# EAGLE design Brain (EAGLE 9.3.1)
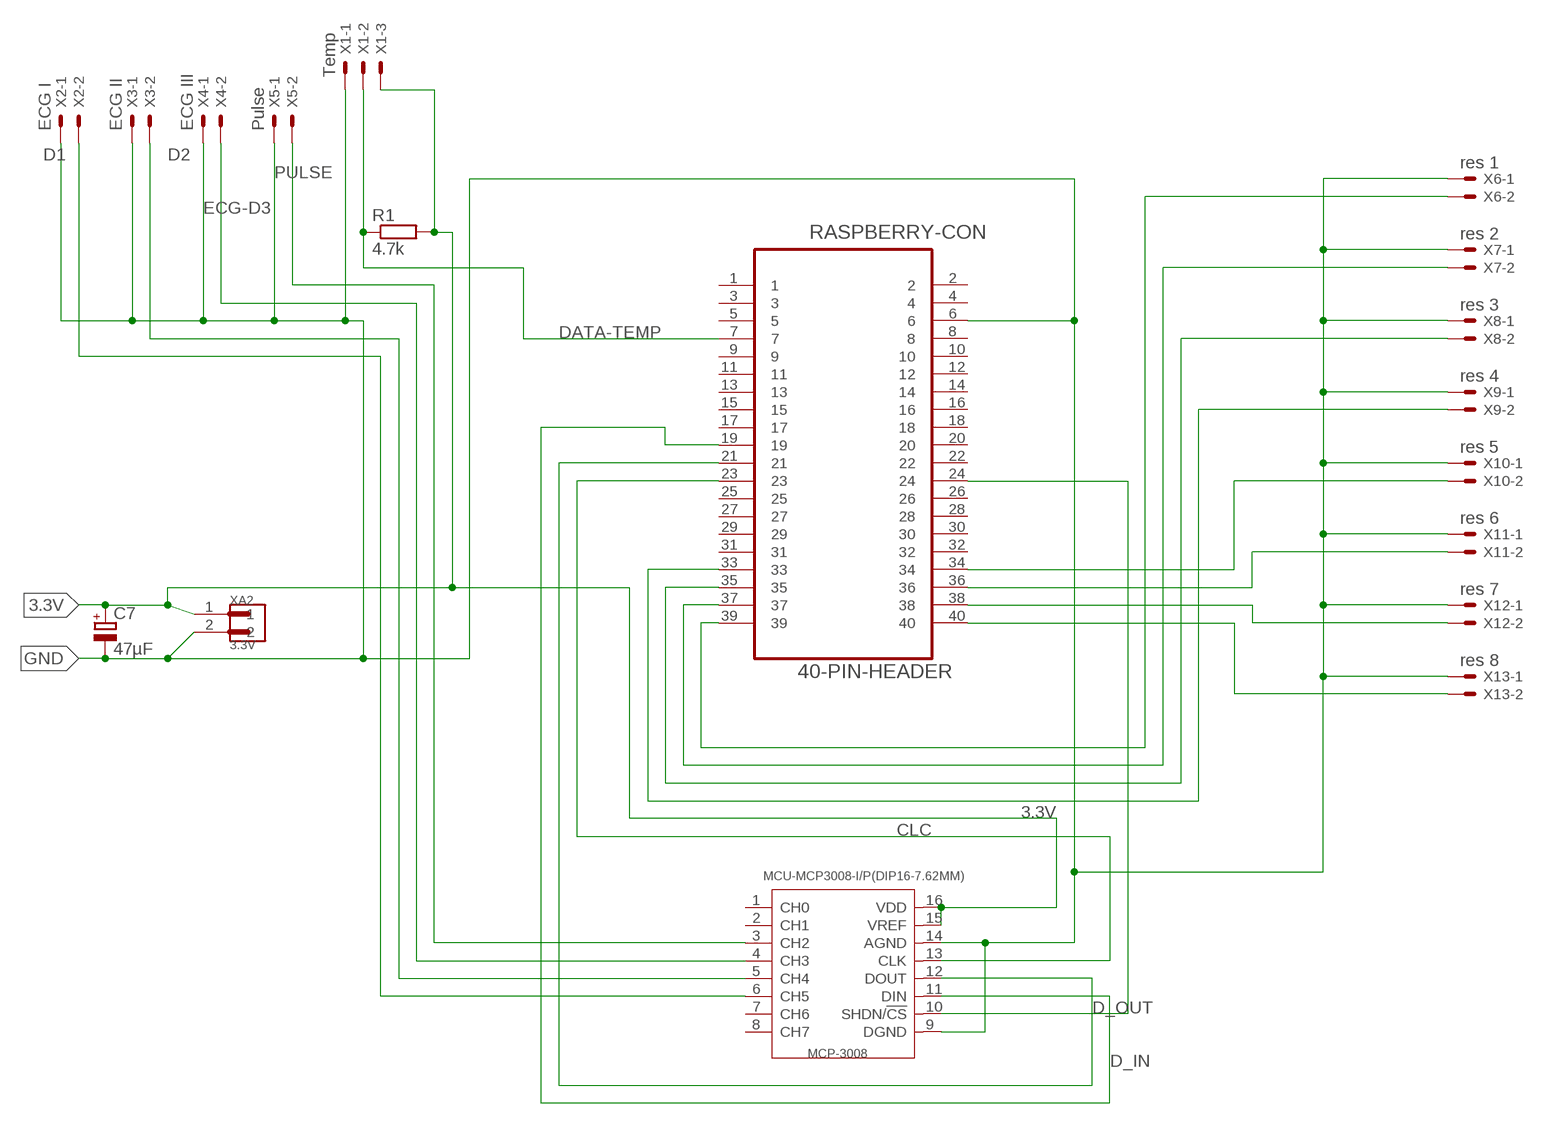
[diagram p0: schematic, sheet 1]

## Parts
C7  47µF  CPOL-EUE2,5-6E  [E2,5-6E]
MCP-3008  MCU-MCP3008-I/P(DIP16-7.62MM)  [DIP16-2.54-19.2X7.62MM]
R1  4.7k  R-EU_0207/7  [0207/7]
RASPBERRY-CON  40-PIN-HEADER  TSW-120-09-F-Q  [SAMTEC_TSW-120-09-F-Q]
X1  Temp  JST-XH-03-PIN-LONG-PAD  [JST-XH-03-PACKAGE-LONG-PAD]
X2  ECG I  JST-XH-02-PIN-LONG-PAD  [JST-XH-02-PACKAGE-LONG-PAD]
X3  ECG II  JST-XH-02-PIN-LONG-PAD  [JST-XH-02-PACKAGE-LONG-PAD]
X4  ECG III  JST-XH-02-PIN-LONG-PAD  [JST-XH-02-PACKAGE-LONG-PAD]
X5  Pulse  JST-XH-02-PIN-LONG-PAD  [JST-XH-02-PACKAGE-LONG-PAD]
X6  res 1  JST-XH-02-PIN-LONG-PAD  [JST-XH-02-PACKAGE-LONG-PAD]
X7  res 2  JST-XH-02-PIN-LONG-PAD  [JST-XH-02-PACKAGE-LONG-PAD]
X8  res 3  JST-XH-02-PIN-LONG-PAD  [JST-XH-02-PACKAGE-LONG-PAD]
X9  res 4  JST-XH-02-PIN-LONG-PAD  [JST-XH-02-PACKAGE-LONG-PAD]
X10  res 5  JST-XH-02-PIN-LONG-PAD  [JST-XH-02-PACKAGE-LONG-PAD]
X11  res 6  JST-XH-02-PIN-LONG-PAD  [JST-XH-02-PACKAGE-LONG-PAD]
X12  res 7  JST-XH-02-PIN-LONG-PAD  [JST-XH-02-PACKAGE-LONG-PAD]
X13  res 8  JST-XH-02-PIN-LONG-PAD  [JST-XH-02-PACKAGE-LONG-PAD]
XA2  3.3V  B2P-VH(LF)(SN)  [JST_B2P-VH(LF)(SN)]

## Nets
3.3V [supply]: C7.+ MCP-3008.15(VREF) MCP-3008.16(VDD) R1.2 X1.3 XA2.1
CLC: MCP-3008.13(CLK) RASPBERRY-CON.23
D1: MCP-3008.6(CH5) X2.2
D2: MCP-3008.5(CH4) X3.2
D_IN: MCP-3008.11(DIN) RASPBERRY-CON.19
D_OUT: MCP-3008.12(DOUT) RASPBERRY-CON.21
DATA-TEMP: R1.1 RASPBERRY-CON.7 X1.2
ECG-D3: MCP-3008.4(CH3) X4.2
GND [supply]: C7.- MCP-3008.9(DGND) MCP-3008.14(AGND) RASPBERRY-CON.6 X1.1 X2.1 X3.1 X4.1 X5.1 X6.1 X7.1 X8.1 X9.1 X10.1 X11.1 X12.1 X13.1 XA2.2
N$2: RASPBERRY-CON.40 X13.2
N$3: RASPBERRY-CON.38 X12.2
N$4: MCP-3008.10(SHDN/!CS) RASPBERRY-CON.24
N$5: RASPBERRY-CON.36 X11.2
N$6: RASPBERRY-CON.34 X10.2
N$7: RASPBERRY-CON.39 X6.2
N$8: RASPBERRY-CON.37 X7.2
N$9: RASPBERRY-CON.35 X8.2
N$10: RASPBERRY-CON.33 X9.2
PULSE: MCP-3008.3(CH2) X5.2
Unconnected: MCP-3008.1(CH0) MCP-3008.2(CH1) MCP-3008.7(CH6) MCP-3008.8(CH7) RASPBERRY-CON.1 RASPBERRY-CON.2 RASPBERRY-CON.3 RASPBERRY-CON.4 RASPBERRY-CON.5 RASPBERRY-CON.8 RASPBERRY-CON.9 RASPBERRY-CON.10 RASPBERRY-CON.11 RASPBERRY-CON.12 RASPBERRY-CON.13 RASPBERRY-CON.14 RASPBERRY-CON.15 RASPBERRY-CON.16 RASPBERRY-CON.17 RASPBERRY-CON.18 RASPBERRY-CON.20 RASPBERRY-CON.22 RASPBERRY-CON.25 RASPBERRY-CON.26 RASPBERRY-CON.27 RASPBERRY-CON.28 RASPBERRY-CON.29 RASPBERRY-CON.30 RASPBERRY-CON.31 RASPBERRY-CON.32

## Library data of the parts
C7 = rcl:CPOL-EU: POLARIZED CAPACITOR, European symbol; SPICEPREFIX: C
MCP-3008 = MCU-MCP3008-I_P_DIP16-7.62MM_:MCU-MCP3008-I/P(DIP16-7.62MM): 310990040; AVAILABILITY: Unavailable; DESCRIPTION: 8 Channel SPI Serial Interface 2.7 V 10-Bit A/D Converter Through Hole - PDIP-16; MF: Microchip; MP: MCP3008-I/P; PACKAGE: DIP-16 Microchip; PRICE: None
R1 = resistor:R-EU_: RESISTOR, European symbol
RASPBERRY-CON = PINheader40:TSW-120-09-F-Q: POST HEADER , THROUGH-HOLE; AVAILABILITY: Unavailable; DESCRIPTION: Conn Unshrouded Header HDR 40 POS 2.54mm Solder ST Thru-Hole; MF: Samtec; MP: TSW-120-09-F-Q; PACKAGE: None; PRICE: None
X1 = Rembrandt Electronics - JST XH Connectors v1-0:JST-XH-03-PIN: JST XH Connector 2 Pin Wire to board connector. Pitch: 2,54 mm, (0.100") Number of pins: 3 Created by Rembrandt Electronics www.rembrandtelectronics.com
X2-X13 = Rembrandt Electronics - JST XH Connectors v1-0:JST-XH-02-PIN: JST XH Connector 2 Pin Wire to board connector. Pitch: 2,54 mm, (0.100") Number of pins: 2 Created by Rembrandt Electronics www.rembrandtelectronics.com
XA2 = B2P-VH_LF__SN_:B2P-VH(LF)(SN): VH Series 3.96 mm Pitch, Compact, Lock Mechanism also Prevents Misinsertion; AVAILABILITY: Good; DESCRIPTION: VH Series 3.96 mm Pitch, Compact, Lock Mechanism also Prevents Misinsertion; MF: JST; MP: B2P-VH_LF__SN_; PACKAGE: FakePackage u; PRICE: 0.11 USD

## Net classes
0 signals: width 0.406 mm, clearance 0.305 mm
1 supply: width 0.61 mm, clearance 0.406 mm

## Board
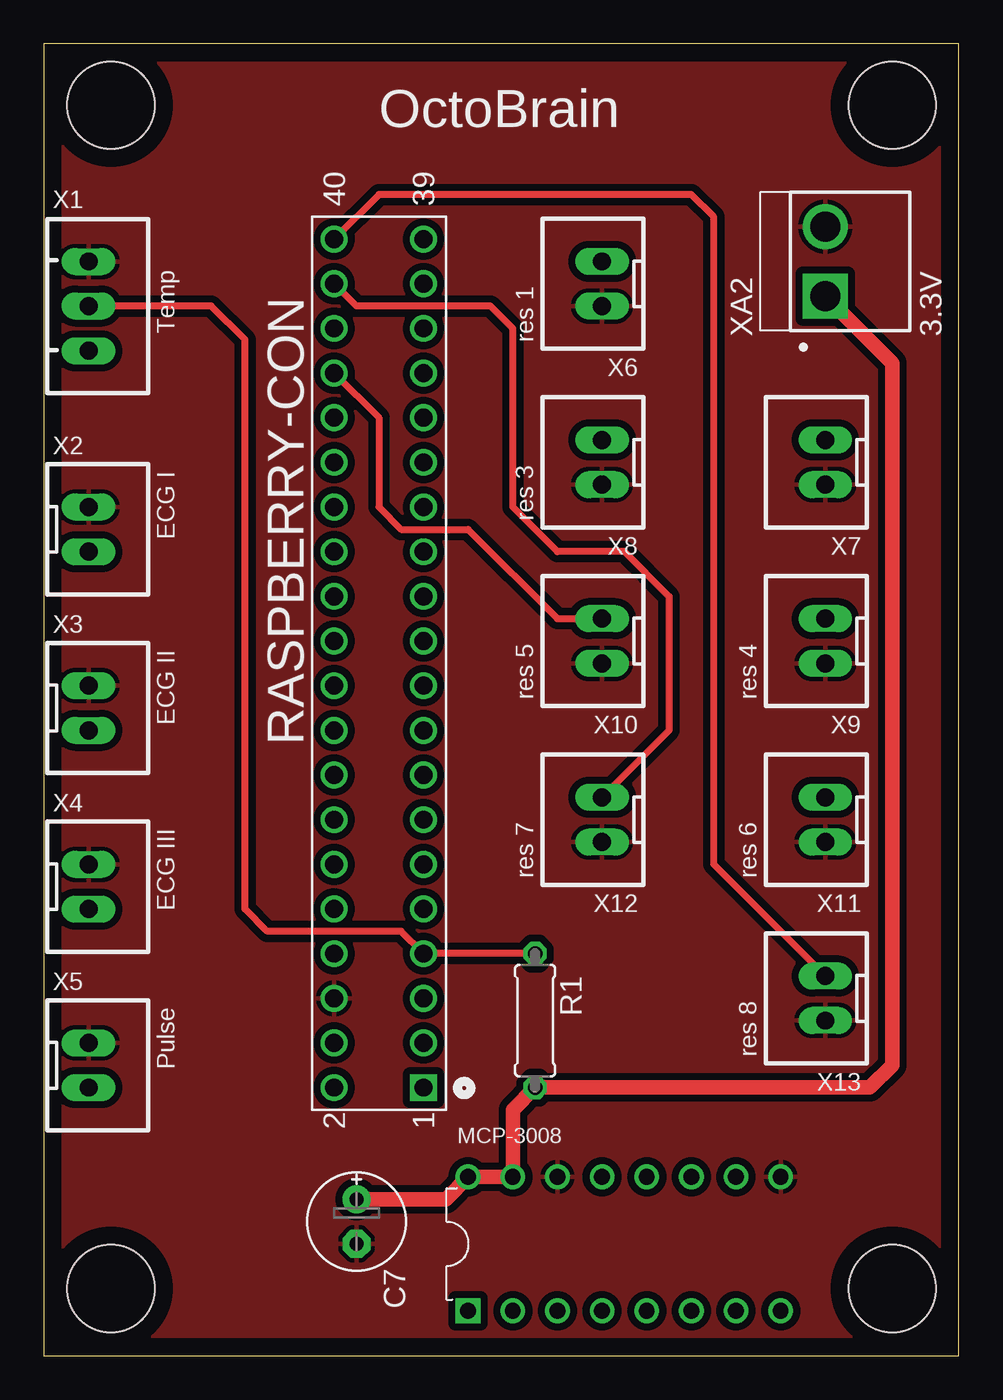
[diagram p1: board, top side]
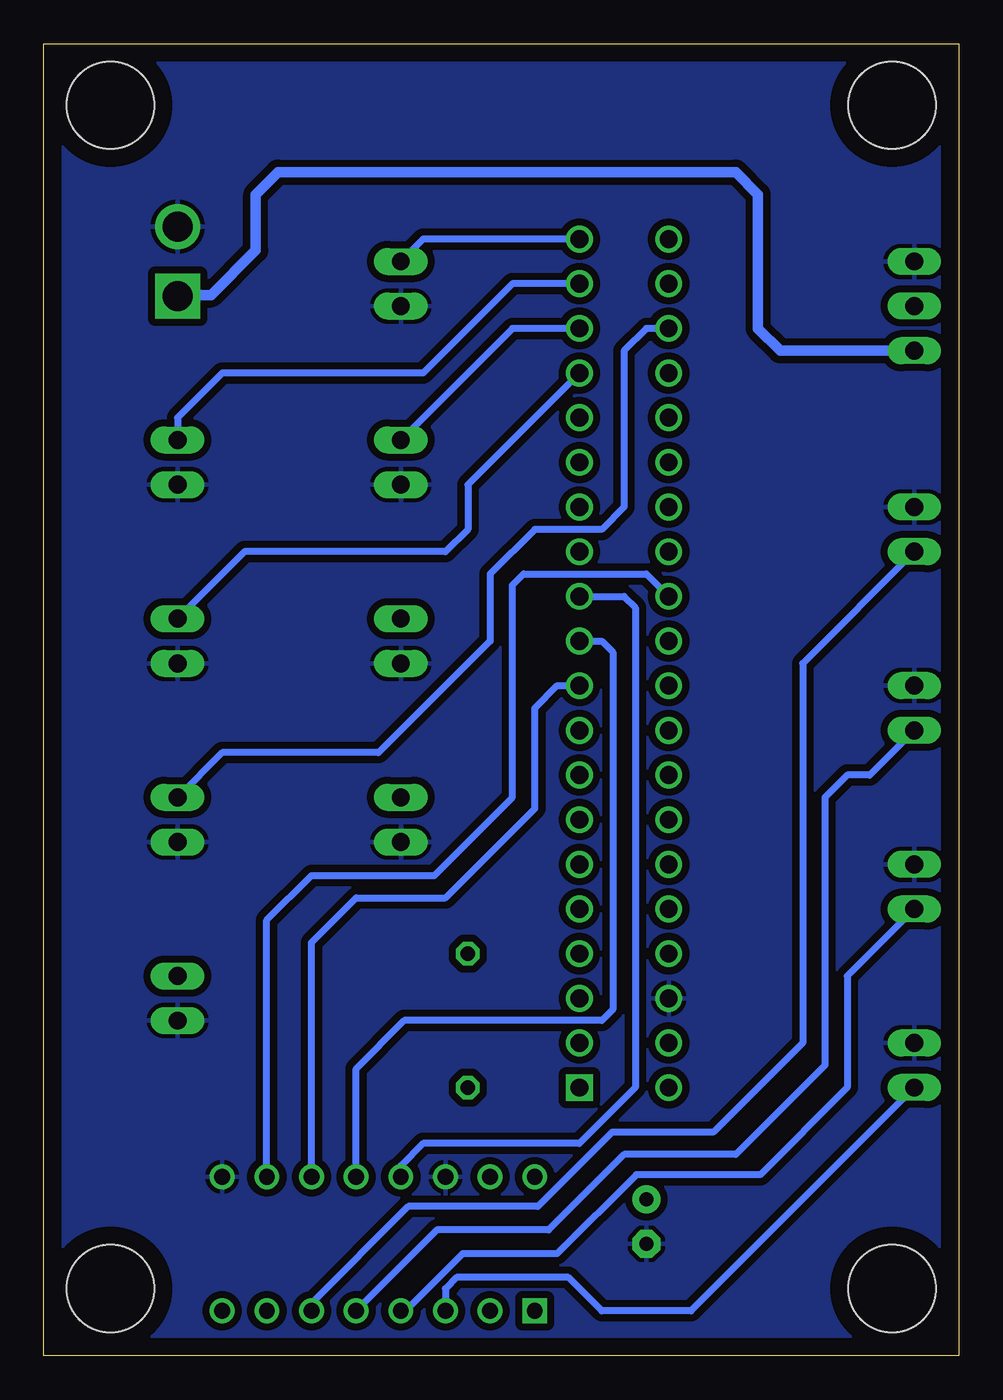
[diagram p2: board, bottom side, seen from below]

Size 52.05 x 74.6 mm. Coordinates in mm from the lower left corner, seen from the top.
Outline: 0,0 52.05,0 52.05,74.6 0,74.6 0,0
Copper layers (1*16): Top 0.035mm / dielectric 1.5mm / Bottom 0.035mm
Design rules "default": minimum track width 6mil, minimum drill 0.35mm, track to track 6mil, track to pad 6mil, pad to pad 6mil, via to via 6mil, smd to smd 6mil, copper to edge 40mil, drill to drill 6mil, minimum pad ring 10mil, minimum via ring 8mil, stop-mask expansion 4mil, vias tented up to drill 0mil, thermal gap 10mil
Holes 4.98 mm at 3.81,71.12 48.26,71.12 3.81,3.81 48.26,3.81

### Footprints (pad centres in the part's own frame; a part is rotated, then mirrored left to right if it is on the bottom)
E2,5-6E = drill 0.813 pad 1.575: + -1.27,0 | drill 0.813 pad 1.575 octagon: - 1.27,0
DIP16-2.54-19.2X7.62MM = drill 0.9 pad 1.4 square: 1 -8.89,-3.81 | drill 0.9 pad 1.4: 2 -6.35,-3.81; 3 -3.81,-3.81; 4 -1.27,-3.81; 5 1.27,-3.81; 6 3.81,-3.81; 7 6.35,-3.81; 8 8.89,-3.81; 9 8.89,3.81; 10 6.35,3.81; 11 3.81,3.81; 12 1.27,3.81; 13 -1.27,3.81; 14 -3.81,3.81; 15 -6.35,3.81; 16 -8.89,3.81
0207/7 = drill 0.813 octagon: 1 -3.81,0; 2 3.81,0
SAMTEC_TSW-120-09-F-Q = drill 1.016 square: 1 -48.26,-5.08 | drill 1.016: 2 -48.26,0; 3 -45.72,-5.08; 4 -45.72,0; 5 -43.18,-5.08; 6 -43.18,0; 7 -40.64,-5.08; 8 -40.64,0; 9 -38.1,-5.08; 10 -38.1,0; 11 -35.56,-5.08; 12 -35.56,0; 13 -33.02,-5.08; 14 -33.02,0; 15 -30.48,-5.08; 16 -30.48,0; 17 -27.94,-5.08; 18 -27.94,0; 19 -25.4,-5.08; 20 -25.4,0; 21 -22.86,-5.08; 22 -22.86,0; 23 -20.32,-5.08; 24 -20.32,0; 25 -17.78,-5.08; 26 -17.78,0; 27 -15.24,-5.08; 28 -15.24,0; 29 -12.7,-5.08; 30 -12.7,0; 31 -10.16,-5.08; 32 -10.16,0; 33 -7.62,-5.08; 34 -7.62,0; 35 -5.08,-5.08; 36 -5.08,0; 37 -2.54,-5.08; 38 -2.54,0; 39 0,-5.08; 40 0,0
JST-XH-03-PACKAGE-LONG-PAD = drill 1.016 long: 1 -2.54,0; 2 0,0; 3 2.54,0
JST-XH-02-PACKAGE-LONG-PAD = drill 1.016 long: 1 -1.27,0; 2 1.27,0
JST_B2P-VH(LF)(SN) = drill 1.7 square: 1 -1.98,0 | drill 1.7: 2 1.98,0

### Placement (x,y rotation side)
C7  17.78,7.62 270 top
MCP-3008  33.02,6.35 0 top
R1  27.94,19.05 270 top
RASPBERRY-CON  16.51,63.5 90 top
X1  2.54,59.69 270 top
X2  2.54,46.99 270 top
X3  2.54,36.83 270 top
X4  2.54,26.67 270 top
X5  2.54,16.51 270 top
X6  31.75,60.96 90 top
X7  44.45,50.8 90 top
X8  31.75,50.8 90 top
X9  44.45,40.64 90 top
X10  31.75,40.64 90 top
X11  44.45,30.48 90 top
X12  31.75,30.48 90 top
X13  44.45,20.32 90 top
XA2  44.45,62.23 90 top

### Tracks (layer width: path | path; a pad name or v marks a point on that pad's centre or on a via)
3.3V
  Top 0.813: XA2.1 48.26,56.44 48.26,16.51 46.99,15.24 R1.2 26.67,13.97 MCP-3008.15 MCP-3008.16 22.86,8.89 C7.+
  Bottom 0.61: XA2.1 44.38,60.33 42.55,60.33 40.01,62.86 40.01,66.04 38.73,67.31 12.7,67.31 11.43,66.04 11.43,58.42 10.16,57.15 X1.3
CLC
  Bottom 0.406: RASPBERRY-CON.23 19.05,43.18 18.41,42.55 18.41,15.24 21.59,12.07 30.48,12.07 31.75,10.79 MCP-3008.13
D1
  Bottom 0.406: X2.2 8.89,39.37 8.89,17.78 13.97,12.7 19.73,12.7 23.95,8.48 31.33,8.48 36.83,2.98 MCP-3008.6
D2
  Bottom 0.406: X3.2 5.08,33.02 6.35,33.02 7.62,31.75 7.62,16.51 12.7,11.43 19.05,11.43 23.34,7.14 29.69,7.14 MCP-3008.5
D_IN
  Bottom 0.406: MCP-3008.11 36.83,23.5 34.29,26.04 29.21,26.04 24.13,31.11 24.13,36.83 22.86,38.1 RASPBERRY-CON.19
D_OUT
  Bottom 0.406: RASPBERRY-CON.21 20.32,40.64 19.68,40 19.68,19.68 20.32,19.05 31.56,19.05 34.29,16.32 MCP-3008.12
DATA-TEMP
  Top 0.406: R1.1 RASPBERRY-CON.7 20.32,24.13 12.7,24.13 11.43,25.4 11.43,57.78 9.53,59.69 X1.2
ECG-D3
  Bottom 0.406: X4.2 6.35,21.59 6.35,15.24 11.3,10.29 18.36,10.29 22.85,5.79 28.23,5.79 31.49,2.54 MCP-3008.4
GND
  pour Bottom: 0,74.3 52.07,74.3 52.07,0 0,0
  pour Top: 0,74.3 52.07,74.3 52.07,0 0,0
N$2
  Top 0.406: X13.2 38.1,27.94 38.1,64.77 36.83,66.04 19.05,66.04 RASPBERRY-CON.40
N$3
  Top 0.406: X12.2 35.56,35.56 35.56,43.18 33.02,45.72 29.21,45.72 26.67,48.26 26.67,58.42 25.4,59.69 17.78,59.69 RASPBERRY-CON.38
N$4
  Bottom 0.406: MCP-3008.10 39.37,24.76 36.83,27.31 29.84,27.31 25.4,31.75 25.4,43.81 24.77,44.45 17.78,44.45 RASPBERRY-CON.24
N$5
  Bottom 0.406: RASPBERRY-CON.36 17.78,58.42 19.05,57.15 19.05,48.26 20.32,46.99 24.13,46.99 26.67,44.45 26.67,40.64 33.02,34.29 41.91,34.29 X11.2
N$6
  Top 0.406: RASPBERRY-CON.34 19.05,53.34 19.05,48.26 20.32,46.99 24.13,46.99 29.21,41.91 X10.2
N$7
  Bottom 0.406: X6.2 30.48,63.5 RASPBERRY-CON.39
N$8
  Bottom 0.406: RASPBERRY-CON.37 25.4,60.96 30.48,55.88 41.91,55.88 44.45,53.34 X7.2
N$9
  Bottom 0.406: RASPBERRY-CON.35 25.4,58.42 X8.2
N$10
  Bottom 0.406: RASPBERRY-CON.33 27.94,49.53 27.94,46.99 29.21,45.72 40.64,45.72 X9.2
PULSE
  Bottom 0.406: X5.2 15.24,2.54 20.32,2.54 22.23,4.45 28.57,4.45 29.21,3.81 MCP-3008.3

### Text on the board
tNames: OctoBrain